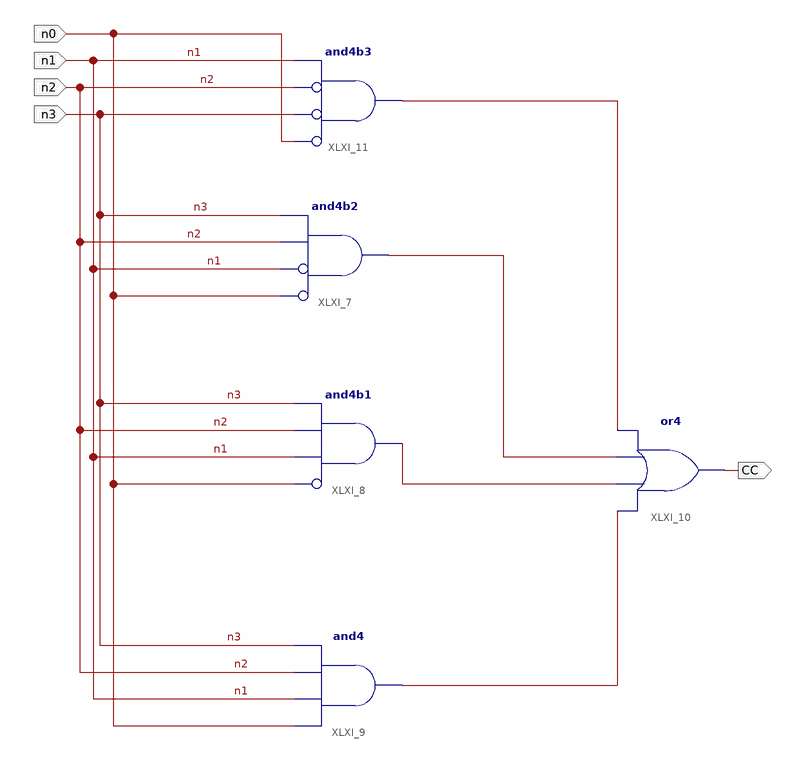
[diagram p0: schematic sheet 1]
// Xilinx ISE schematic C.sch (spartan3e) as structural Verilog: 5 symbols, 5 ports
module C (
  input  n0,
  input  n1,
  input  n2,
  input  n3,
  output CC
);

  wire XLXN_3, XLXN_4, XLXN_5, XLXN_7;

  and XLXI_7 (XLXN_3, ~n0, ~n1, n2, n3);  // and4b2
  and XLXI_8 (XLXN_4, ~n0, n1, n2, n3);  // and4b1
  and XLXI_9 (XLXN_5, n0, n1, n2, n3);
  or XLXI_10 (CC, XLXN_5, XLXN_4, XLXN_3, XLXN_7);
  and XLXI_11 (XLXN_7, ~n0, ~n3, ~n2, n1);  // and4b3
endmodule
